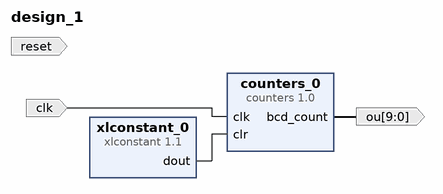
[diagram p0: block diagram of the top level]
# Vivado block design design_1, xc7a35tcpg236-1, Vivado 2023.1
create_bd_design design_1

create_bd_port -dir I clk
create_bd_port -dir I reset
create_bd_port -dir O -from 9 -to 0 ou

create_bd_cell -type ip -vlnv xilinx.com:XUP:counters:1.0 counters_0
set_property -dict {CONFIG.COUNT_SIZE 10 CONFIG.TYPE 2} [get_bd_cells counters_0]
create_bd_cell -type ip -vlnv xilinx.com:ip:xlconstant:1.1 xlconstant_0
set_property -dict {CONFIG.CONST_VAL 0} [get_bd_cells xlconstant_0]

# ---- connections ----

connect_bd_net [get_bd_ports clk] [get_bd_pins counters_0/clk]
connect_bd_net [get_bd_pins counters_0/bcd_count] [get_bd_ports ou]
connect_bd_net [get_bd_pins xlconstant_0/dout] [get_bd_pins counters_0/clr]

validate_bd_design
save_bd_design
